# Altium project 分控板.PrjPcb
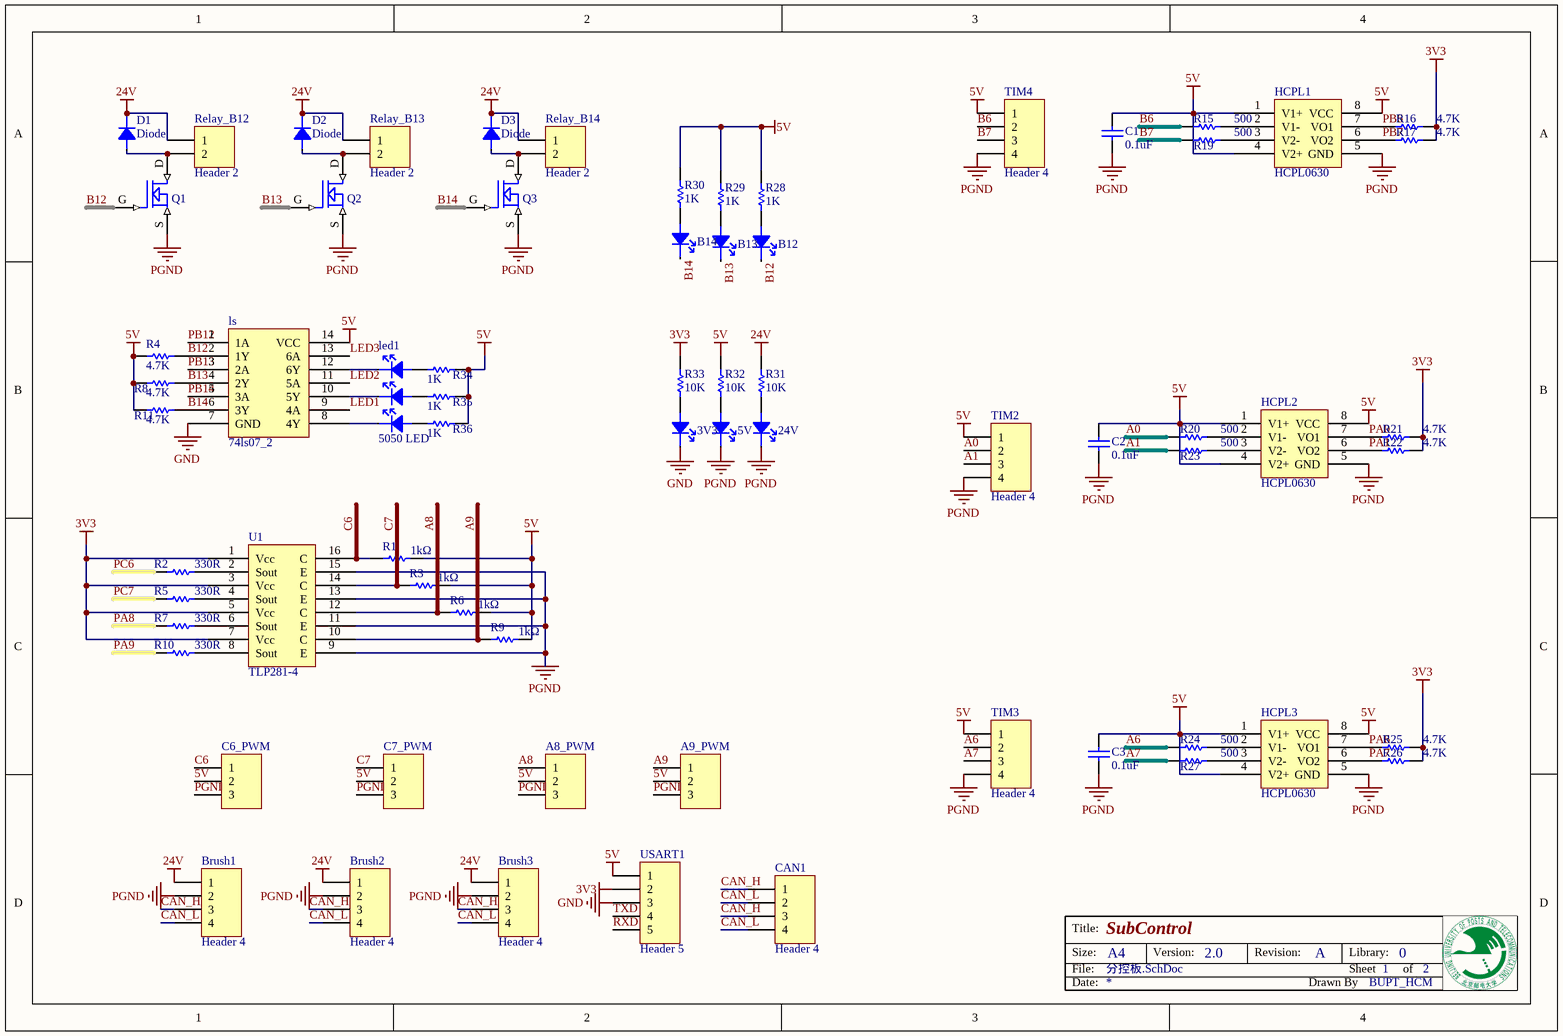
[diagram p0: 分控板.SchDoc]
1 sheet, 68 parts. Net scope: global (net labels, ports and power ports of the same name join across sheets).
Board file: 分控板.PcbDoc

## Sheet 分控板.SchDoc: SubControl
size A4; DrawnBy: BUPT_HCM; Revision: A; SheetNumber: 1; SheetTotal: 2; Version: 2.0; LibVersion: 0

### Parts
3V3  lED  [0805D]  (value not drawn)
5V  lED  [0805D]  (value not drawn)
24V  lED  [0805D]  (value not drawn)
A8_PWM  Header 3  [Green 3P]  (value not drawn)
A9_PWM  Header 3  [Green 3P]  (value not drawn)
B12  lED  [0805D]  (value not drawn)
B13  lED  [0805D]  (value not drawn)
B14  lED  [0805D]  (value not drawn)
Brush1  Header 4  [Green_4P]
Brush2  Header 4  [Green_4P]
Brush3  Header 4  [Green_4P]
C1  value 0.1uF  [CAP-MLCC-0603]  (hidden comment: Cap)
C2  value 0.1uF  [CAP-MLCC-0603]  (hidden comment: Cap)
C3  value 0.1uF  [CAP-MLCC-0603]  (hidden comment: Cap)
C6_PWM  Header 3  [Green 3P]  (value not drawn)
C7_PWM  Header 3  [Green 3P]  (value not drawn)
CAN1  Header 4  [Green_4P]
D1  Diode  [SS34]
D2  Diode  [SS34]
D3  Diode  [SS34]
HCPL1  HCPL0630  [SOIC8]
HCPL2  HCPL0630  [SOIC8]
HCPL3  HCPL0630  [SOIC8]
led1  5050 LED  [5050LED]
ls  74ls07_2  [74ls07]
Q1  MOSFET N  [NMOS_SOT23]  (value not drawn)
Q2  MOSFET N  [NMOS_SOT23]  (value not drawn)
Q3  MOSFET N  [NMOS_SOT23]  (value not drawn)
R1  value 1kΩ  [RES-0603]  (hidden comment: RES)
R2  value 330R  [RES-0603]  (hidden comment: RES)
R3  value 1kΩ  [RES-0603]  (hidden comment: RES)
R4  value 4.7K  [RES-0603]  (hidden comment: RES)
R5  value 330R  [RES-0603]  (hidden comment: RES)
R6  value 1kΩ  [RES-0603]  (hidden comment: RES)
R7  value 330R  [RES-0603]  (hidden comment: RES)
R8  value 4.7K  [RES-0603]  (hidden comment: RES)
R9  value 1kΩ  [RES-0603]  (hidden comment: RES)
R10  value 330R  [RES-0603]  (hidden comment: RES)
R11  value 4.7K  [RES-0603]  (hidden comment: RES)
R15  value 500  [RES-0603]  (hidden comment: Res1)
R16  value 4.7K  [RES-0603]  (hidden comment: Res1)
R17  value 4.7K  [RES-0603]  (hidden comment: Res1)
R19  value 500  [RES-0603]  (hidden comment: Res1)
R20  value 500  [RES-0603]  (hidden comment: Res1)
R21  value 4.7K  [RES-0603]  (hidden comment: Res1)
R22  value 4.7K  [RES-0603]  (hidden comment: Res1)
R23  value 500  [RES-0603]  (hidden comment: Res1)
R24  value 500  [RES-0603]  (hidden comment: Res1)
R25  value 4.7K  [RES-0603]  (hidden comment: Res1)
R26  value 4.7K  [RES-0603]  (hidden comment: Res1)
R27  value 500  [RES-0603]  (hidden comment: Res1)
R28  value 1K  [RES-0603]  (hidden comment: RES)
R29  value 1K  [RES-0603]  (hidden comment: RES)
R30  value 1K  [RES-0603]  (hidden comment: RES)
R31  value 10K  [RES-0603]  (hidden comment: RES)
R32  value 10K  [RES-0603]  (hidden comment: RES)
R33  value 10K  [RES-0603]  (hidden comment: RES)
R34  value 1K  [RES-0603]  (hidden comment: RES)
R35  value 1K  [RES-0603]  (hidden comment: RES)
R36  value 1K  [RES-0603]  (hidden comment: RES)
Relay_B12  Header 2  [Green_2P]
Relay_B13  Header 2  [Green_2P]
Relay_B14  Header 2  [Green_2P]
TIM2  Header 4  [Green_4P]
TIM3  Header 4  [Green_4P]
TIM4  Header 4  [Green_4P]
U1  TLP281-4  [SOP16]
USART1  Header 5  [Green_5P]

### Nets
3V3: R16.2 R17.2 R21.2 R22.2 R25.2 R26.2 R33.1 U1.1(Vcc) U1.3(Vcc) U1.5(Vcc) U1.7(Vcc) USART1.2
5V: A8_PWM.2 A9_PWM.2 C1.1 C2.1 C3.1 C6_PWM.2 C7_PWM.2 HCPL1.1(V1+) HCPL1.4(V2+) HCPL1.8(VCC) HCPL2.1(V1+) HCPL2.4(V2+) HCPL2.8(VCC) HCPL3.1(V1+) HCPL3.4(V2+) HCPL3.8(VCC) ls.14(VCC) R1.2 R3.2 R4.1 R6.2 R8.1 R9.2 R11.1 R28.1 R29.1 R30.1 R32.1 R34.2 R35.2 R36.2 TIM2.1 TIM3.1 TIM4.1 USART1.1
24V: Brush1.1 Brush2.1 Brush3.1 D1.K D2.K D3.K R31.1 Relay_B12.1 Relay_B13.1 Relay_B14.1
GND: 3V3.K ls.7(GND) USART1.3
PGND: 5V.K 24V.K A8_PWM.3 A9_PWM.3 Brush1.2 Brush2.2 Brush3.2 C1.2 C2.2 C3.2 C6_PWM.3 C7_PWM.3 HCPL1.5(GND) HCPL2.5(GND) HCPL3.5(GND) Q1.S Q2.S Q3.S TIM2.4 TIM3.4 TIM4.4 U1.9(E) U1.11(E) U1.13(E) U1.15(E)
A0: R20.1 TIM2.2
A1: R23.1 TIM2.3
A6: R24.1 TIM3.2
A7: R27.1 TIM3.3
A8: A8_PWM.1 R6.1 U1.12(C)
A9: A9_PWM.1 R9.1 U1.10(C)
B6: R15.1 TIM4.2
B7: R19.1 TIM4.3
B12: B12.K ls.2(1Y) Q1.G R4.2
B13: B13.K ls.4(2Y) Q2.G R8.2
B14: B14.K ls.6(3Y) Q3.G R11.2
C6: C6_PWM.1 R1.1 U1.16(C)
C7: C7_PWM.1 R3.1 U1.14(C)
CAN_H: Brush1.3 Brush2.3 Brush3.3 CAN1.1 CAN1.3
CAN_L: Brush1.4 Brush2.4 Brush3.4 CAN1.2 CAN1.4
LED1: ls.9(4A)
LED2: ls.11(5A)
LED3: ls.13(6A)
PA0: HCPL2.7(VO1) R21.1
PA1: HCPL2.6(VO2) R22.1
PA6: HCPL3.7(VO1) R25.1
PA7: HCPL3.6(VO2) R26.1
PA8: R7.1
PA9: R10.1
PB6: HCPL1.7(VO1) R16.1
PB7: HCPL1.6(VO2) R17.1
PB12: ls.1(1A)
PB13: ls.3(2A)
PB14: ls.5(3A)
PC6: R2.1
PC7: R5.1
RXD: USART1.5
TXD: USART1.4
Net3V3_A: 3V3.A R33.2
Net5V_A: 5V.A R32.2
Net24V_A: 24V.A R31.2
NetB12_A: B12.A R28.2
NetB13_A: B13.A R29.2
NetB14_A: B14.A R30.2
NetD1_A: D1.A Q1.D Relay_B12.2
NetD2_A: D2.A Q2.D Relay_B13.2
NetD3_A: D3.A Q3.D Relay_B14.2
NetHCPL1_2: HCPL1.2(V1-) R15.2
NetHCPL1_3: HCPL1.3(V2-) R19.2
NetHCPL2_2: HCPL2.2(V1-) R20.2
NetHCPL2_3: HCPL2.3(V2-) R23.2
NetHCPL3_2: HCPL3.2(V1-) R24.2
NetHCPL3_3: HCPL3.3(V2-) R27.2
Netled1_A1: led1.A1 R34.1
Netled1_A2: led1.A2 R35.1
Netled1_A3: led1.A3 R36.1
Netled1_K1: led1.K1 ls.12(6Y)
Netled1_K2: led1.K2 ls.10(5Y)
Netled1_K3: led1.K3 ls.8(4Y)
NetR2_2: R2.2 U1.2(Sout)
NetR5_2: R5.2 U1.4(Sout)
NetR7_2: R7.2 U1.6(Sout)
NetR10_2: R10.2 U1.8(Sout)

### Notes on the sheet
- Title:
- Size:
- Date:
- File:
- A4
- Version:
- Revision:
- Drawn By
- Sheet
- Library:
- of

### Library data of the parts
3V3 5V 24V B12-B14 = 00-D-LED
A8_PWM A9_PWM C6_PWM C7_PWM = Header 3: Header, 3-Pin; LatestRevisionDate: 17-Jul-2002; LatestRevisionNote: Re-released for DXP Platform.; Publisher: Altium Limited
Brush1-Brush3 CAN1 TIM2-TIM4 = Header 4: Header, 4-Pin; LatestRevisionDate: 17-Jul-2002; LatestRevisionNote: Re-released for DXP Platform.; Publisher: Altium Limited
C1-C3 = Cap: Capacitor; Published: 8-Jun-2000; LatestRevisionDate: 17-Jul-2002; LatestRevisionNote: Re-released for DXP Platform.; PackageReference: RAD-0.3; Publisher: Altium Limited
R1-R11 R28-R36 = RES: 电阻; Published: 8-Jun-2000; LatestRevisionDate: 17-Jul-2002; LatestRevisionNote: Re-released for DXP Platform.; PackageReference: AXIAL-0.3; Publisher: Altium Limited; PackageDescription: Axial Device, Thru-Hole; 2 Leads; 0.3 in Pin Spacing
R15-R17 R19-R27 = Res1: Resistor; Published: 8-Jun-2000; LatestRevisionDate: 17-Jul-2002; LatestRevisionNote: Re-released for DXP Platform.; PackageReference: AXIAL-0.3; Publisher: Altium Limited
Relay_B12-Relay_B14 = Header 2: Header, 2-Pin; LatestRevisionDate: 17-Jul-2002; LatestRevisionNote: Re-released for DXP Platform.; Publisher: Altium Limited
U1 = IC-TLP521-4: TLP521-4,TLP281-4
USART1 = Header 5: Header, 5-Pin; LatestRevisionDate: 17-Jul-2002; LatestRevisionNote: Re-released for DXP Platform.; Publisher: Altium Limited